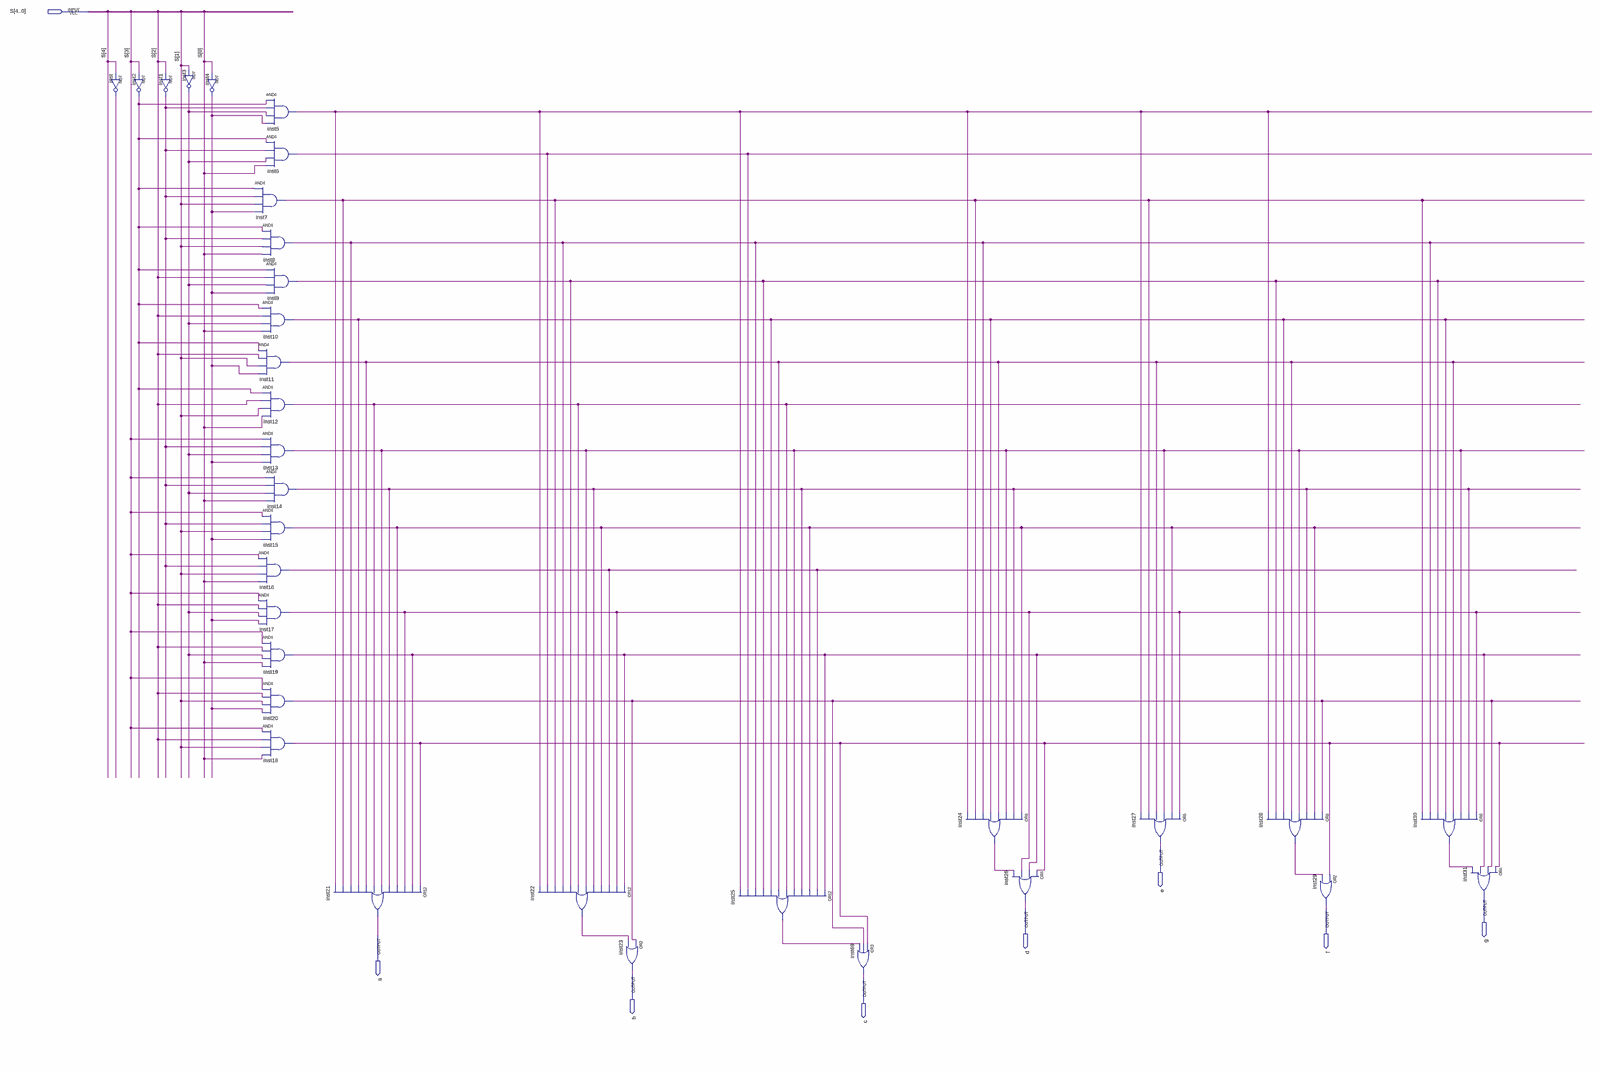
[diagram p0: schematic sheet, whole]
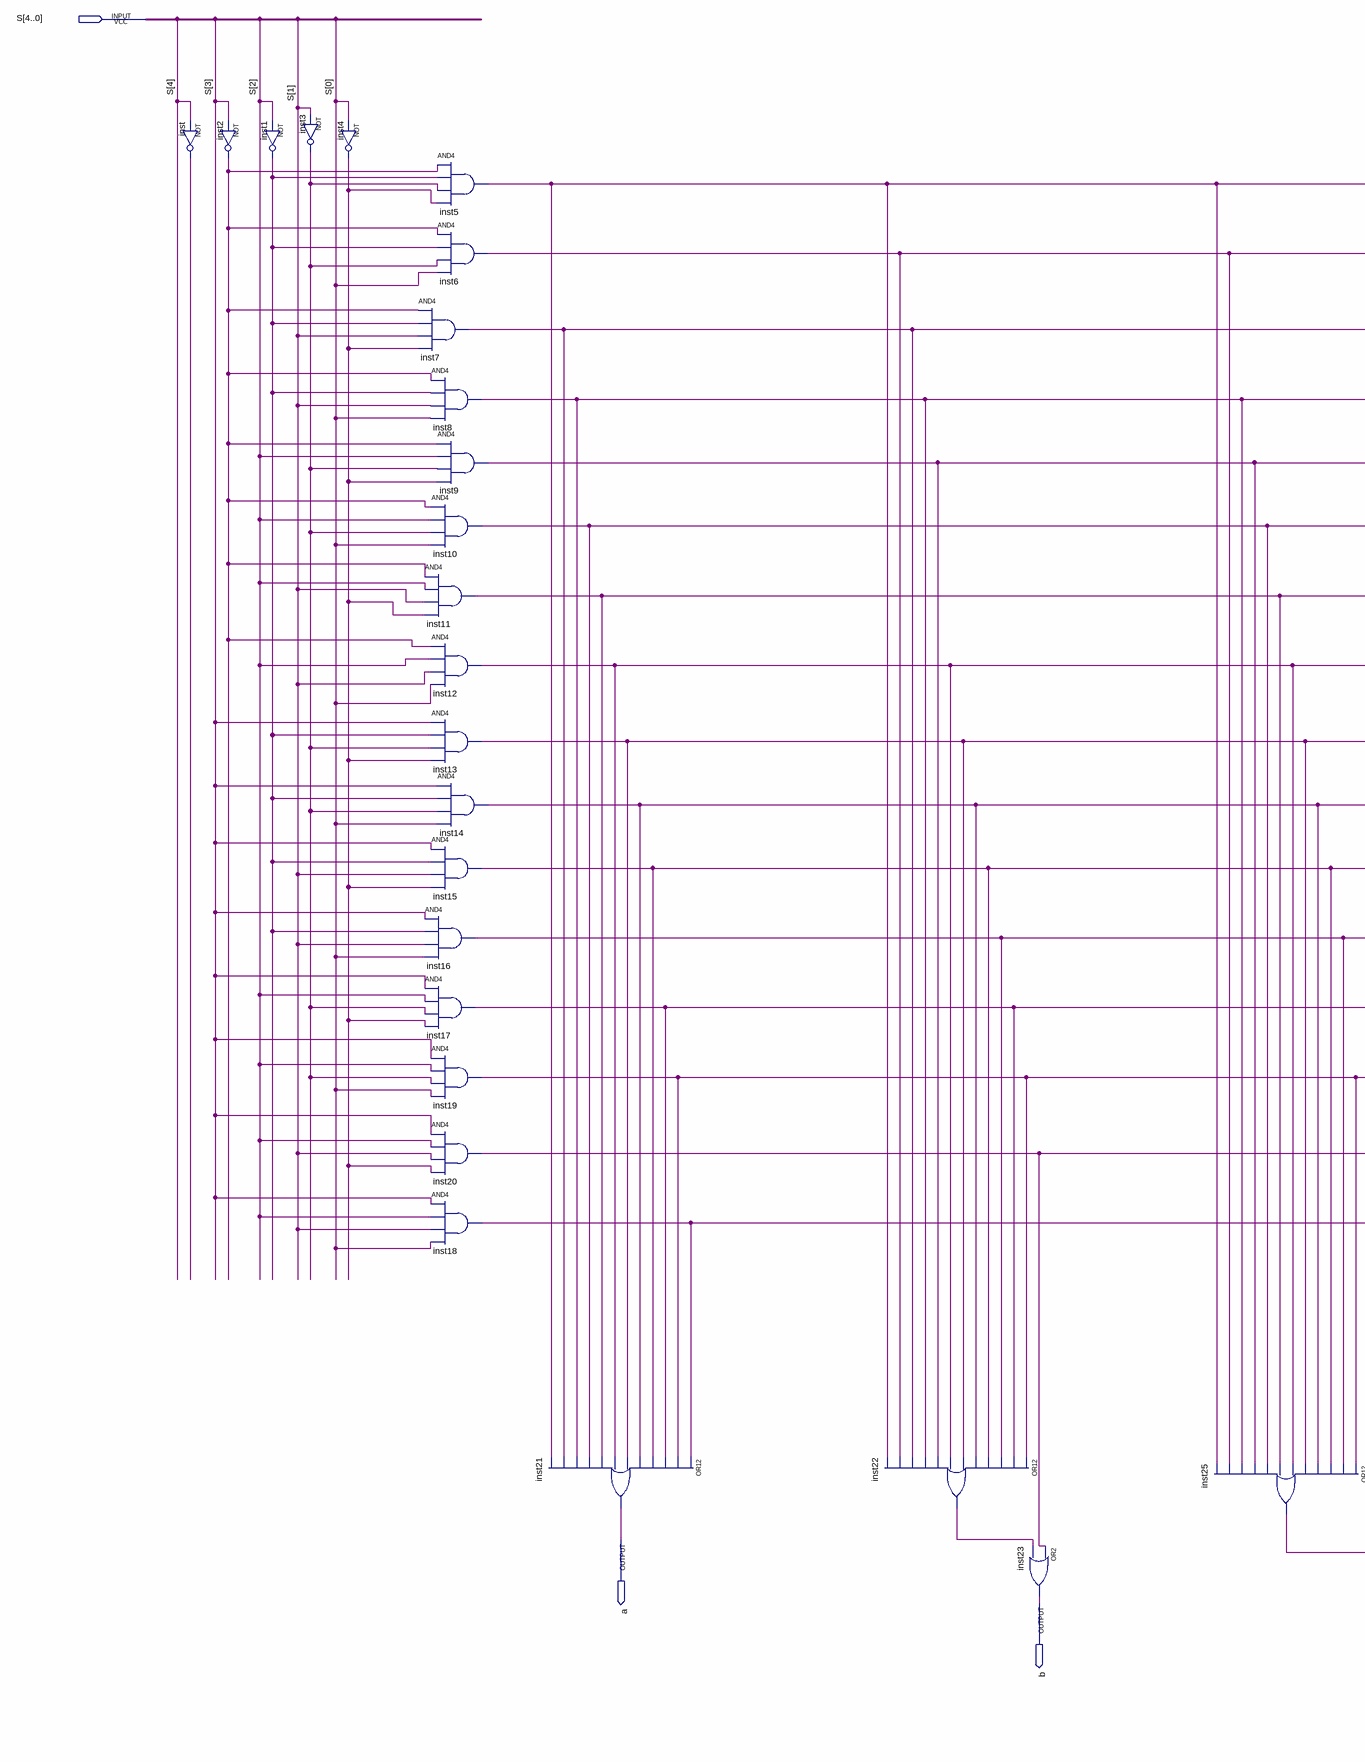
[diagram p1: schematic sheet, left part]
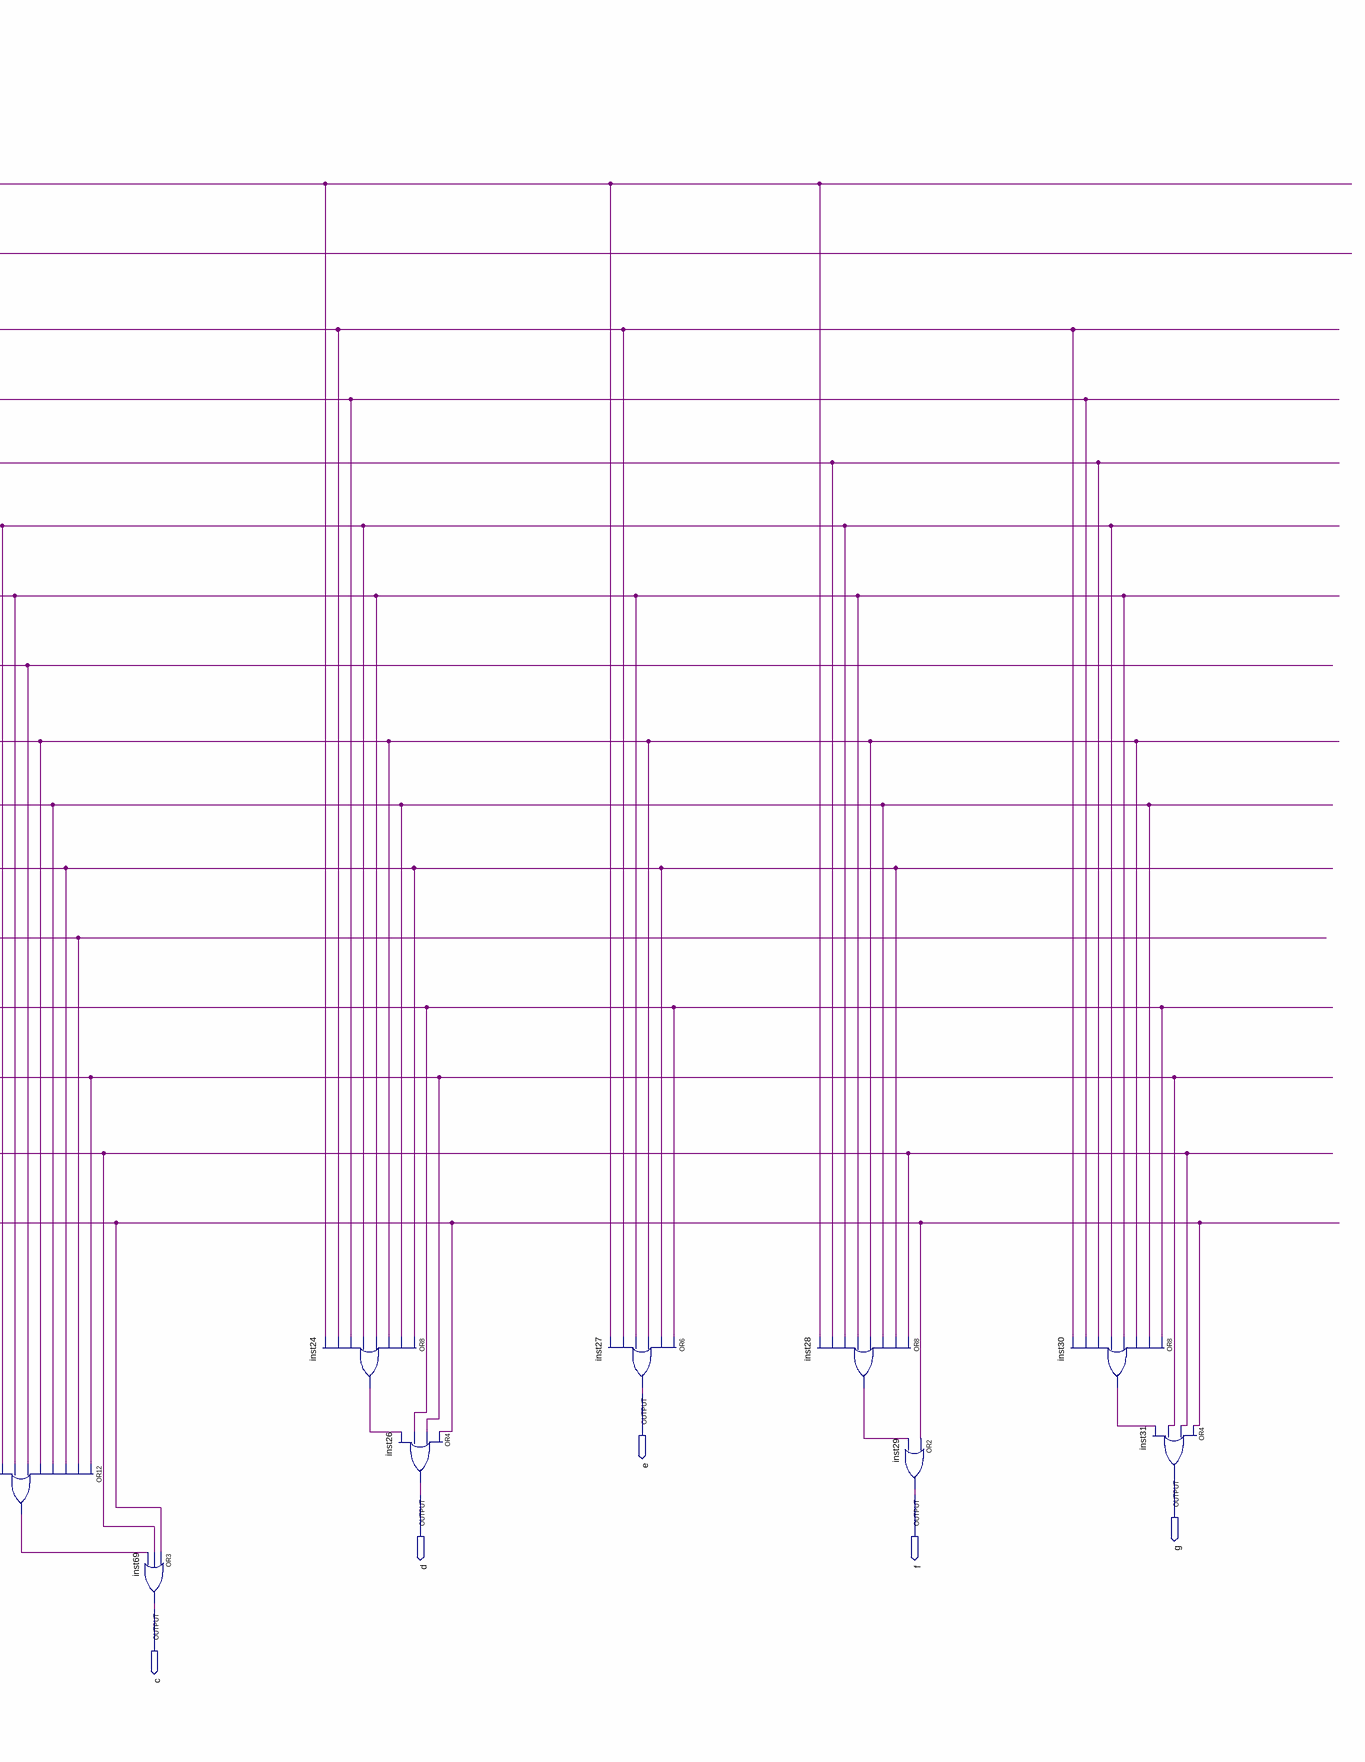
[diagram p2: schematic sheet, right part]
// Quartus schematic display4BitsDireito.bdf as structural Verilog: 33 symbols, 8 pins
module display4BitsDireito (
  input  [4:0] S,
  output e,
  output g,
  output d,
  output f,
  output a,
  output b,
  output c
);

  wire inst1_out, inst2_out, inst3_out, inst4_out, inst5_out, inst6_out, inst7_out, inst8_out, inst9_out,
       inst10_out, inst11_out, inst12_out, inst13_out, inst14_out, inst15_out, inst16_out, inst17_out,
       inst18_out, inst19_out, inst20_out, inst22_out, inst24_out, inst25_out, inst28_out, inst30_out,
       inst_out;

  not inst (inst_out, S[4]);
  not inst2 (inst2_out, S[3]);
  not inst1 (inst1_out, S[2]);
  not inst3 (inst3_out, S[1]);
  not inst4 (inst4_out, S[0]);
  and inst5 (inst5_out, inst2_out, inst1_out, inst3_out, inst4_out);
  and inst6 (inst6_out, inst2_out, inst1_out, inst3_out, S[0]);
  and inst7 (inst7_out, inst2_out, inst1_out, S[1], inst4_out);
  and inst8 (inst8_out, inst2_out, inst1_out, S[1], S[0]);
  and inst9 (inst9_out, inst2_out, S[2], inst3_out, inst4_out);
  and inst10 (inst10_out, inst2_out, S[2], inst3_out, S[0]);
  and inst11 (inst11_out, inst2_out, S[2], S[1], inst4_out);
  and inst12 (inst12_out, inst2_out, S[2], S[1], S[0]);
  and inst13 (inst13_out, S[3], inst1_out, inst3_out, inst4_out);
  and inst14 (inst14_out, S[3], inst1_out, inst3_out, S[0]);
  and inst15 (inst15_out, S[3], inst1_out, S[1], inst4_out);
  and inst16 (inst16_out, S[3], inst1_out, S[1], S[0]);
  and inst17 (inst17_out, S[3], S[2], inst3_out, inst4_out);
  and inst19 (inst19_out, S[3], S[2], inst3_out, S[0]);
  and inst20 (inst20_out, S[3], S[2], S[1], inst4_out);
  and inst18 (inst18_out, S[3], S[2], S[1], S[0]);
  or inst21 (a, inst18_out, inst19_out, inst17_out, inst15_out, inst14_out, inst13_out, inst12_out, inst11_out, inst10_out, inst8_out, inst7_out, inst5_out);
  or inst22 (inst22_out, inst19_out, inst17_out, inst16_out, inst15_out, inst14_out, inst13_out, inst12_out, inst9_out, inst8_out, inst7_out, inst6_out, inst5_out);
  or inst23 (b, inst20_out, inst22_out);
  or inst25 (inst25_out, inst19_out, inst16_out, inst15_out, inst14_out, inst13_out, inst12_out, inst11_out, inst10_out, inst9_out, inst8_out, inst6_out, inst5_out);
  or inst69 (c, inst18_out, inst20_out, inst25_out);
  or inst24 (inst24_out, inst15_out, inst14_out, inst13_out, inst11_out, inst10_out, inst8_out, inst7_out, inst5_out);
  or inst26 (d, inst18_out, inst19_out, inst17_out, inst24_out);
  or inst27 (e, inst17_out, inst15_out, inst13_out, inst11_out, inst7_out, inst5_out);
  or inst28 (inst28_out, inst20_out, inst15_out, inst14_out, inst13_out, inst11_out, inst10_out, inst9_out, inst5_out);
  or inst29 (f, inst18_out, inst28_out);
  or inst30 (inst30_out, inst17_out, inst14_out, inst13_out, inst11_out, inst10_out, inst9_out, inst8_out, inst7_out);
  or inst31 (g, inst18_out, inst20_out, inst19_out, inst30_out);
endmodule
